# EAGLE design ProjV1 (EAGLE 9.6.2)
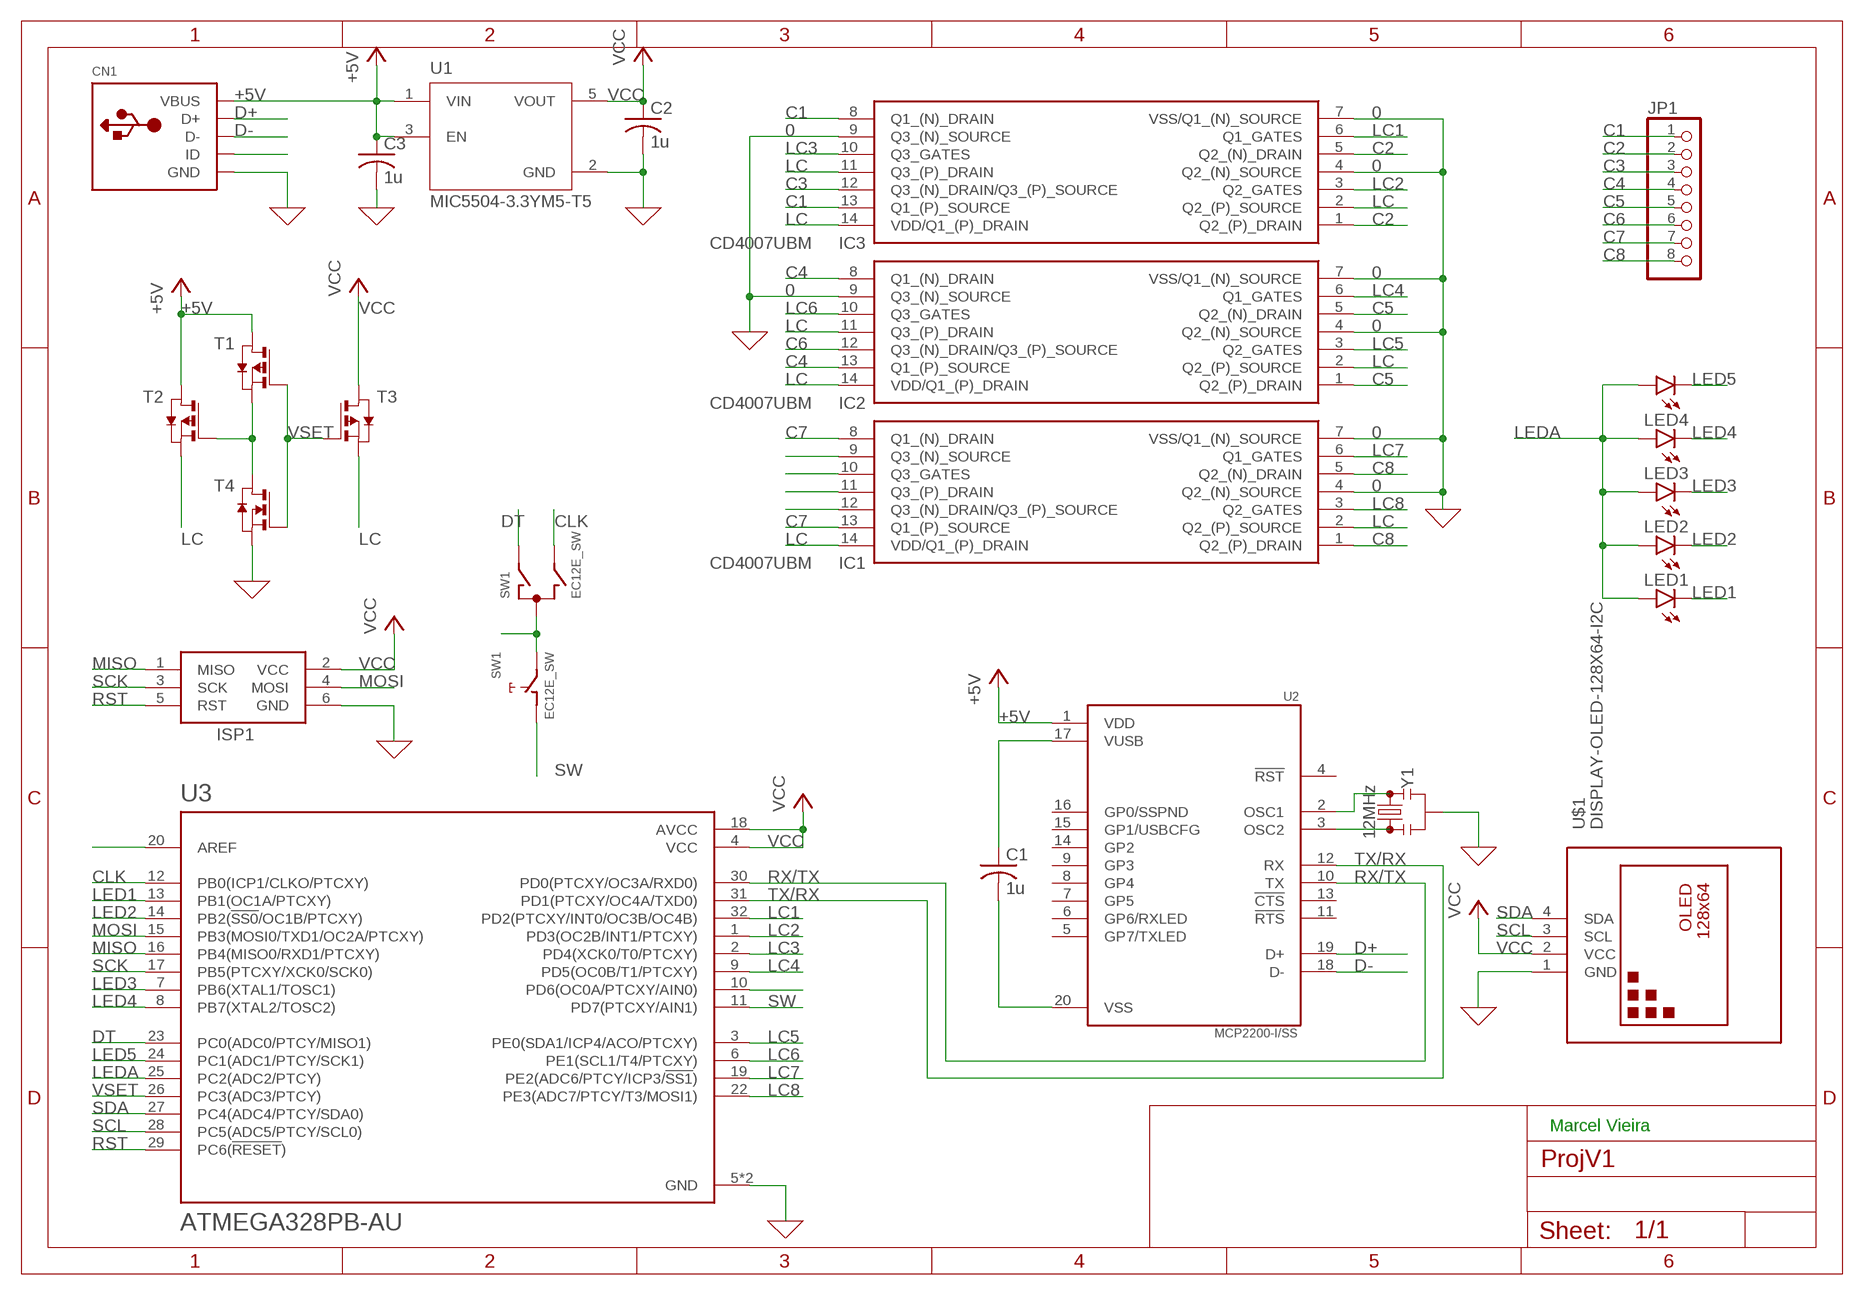
[diagram p0: schematic, sheet 1]

## Parts
C1  1u  C-USC0805  [C0805]
C2  1u  C-USC0805  [C0805]
C3  1u  C-USC0805  [C0805]
CN1  USBMINIB  [USB-MINIB]
IC1  CD4007UBM  [SOIC127P600X175-14N]
IC2  CD4007UBM  [SOIC127P600X175-14N]
IC3  CD4007UBM  [SOIC127P600X175-14N]
ISP1  AVRISP-6  [AVRISP]
JP1  PINHD-1X8-3.5MM  [1X08-3.5MM]
LED1  LEDCHIP-LED0805  [CHIP-LED0805]
LED2  LEDCHIP-LED0805  [CHIP-LED0805]
LED3  LEDCHIP-LED0805  [CHIP-LED0805]
LED4  LEDCHIP-LED0805  [CHIP-LED0805]
LED5  LEDCHIP-LED0805  [CHIP-LED0805]
SW1  EC12E_SW  [ALPS_EC12E_SW]
T1  PMOSSOT23  [SOT-23]
T2  PMOSSOT23  [SOT-23]
T3  PMOSSOT23  [SOT-23]
T4  NMOSSOT23  [SOT-23]
U1  MIC5504-3.3YM5-T5  [SOT95P280X145-5N]
U2  MCP2200-I/SS  [SOP65P780X200-20N]
U3  ATMEGA328PB-AU  [QFP80P900X900X120-32N]
U$1  DISPLAY-OLED-128X64-I2C  [DISPLAY-OLED-128X64-I2C]
Y1  12MHz  RESONATOR-16MHZSMD_3.2X1.3  [RESONATOR-SMD-3.2X1.3]

## Nets
0: C2.2 C3.2 CN1.GND IC1.4(Q2_(N)_SOURCE) IC1.7(VSS/Q1_(N)_SOURCE) IC2.4(Q2_(N)_SOURCE) IC2.7(VSS/Q1_(N)_SOURCE) IC2.9(Q3_(N)_SOURCE) IC3.4(Q2_(N)_SOURCE) IC3.7(VSS/Q1_(N)_SOURCE) IC3.9(Q3_(N)_SOURCE) ISP1.6(GND) T4.2(S) U1.2(GND) U3.5(GND) U3.21(GND) U$1.1(GND) Y1.2 ; supply symbol labelled GND
+5V: C3.1 CN1.VBUS T1.1(D) T2.1(D) U1.1(VIN) U1.3(EN) U2.1(VDD)
C1: IC3.8(Q1_(N)_DRAIN) IC3.13(Q1_(P)_SOURCE) JP1.1
C2: IC3.1(Q2_(P)_DRAIN) IC3.5(Q2_(N)_DRAIN) JP1.2
C3: IC3.12(Q3_(N)_DRAIN/Q3_(P)_SOURCE) JP1.3
C4: IC2.8(Q1_(N)_DRAIN) IC2.13(Q1_(P)_SOURCE) JP1.4
C5: IC2.1(Q2_(P)_DRAIN) IC2.5(Q2_(N)_DRAIN) JP1.5
C6: IC2.12(Q3_(N)_DRAIN/Q3_(P)_SOURCE) JP1.6
C7: IC1.8(Q1_(N)_DRAIN) IC1.13(Q1_(P)_SOURCE) JP1.7
C8: IC1.1(Q2_(P)_DRAIN) IC1.5(Q2_(N)_DRAIN) JP1.8
CLK: SW1.B U3.12(PB0(ICP1/CLKO/PTCXY))
D+: CN1.D+ U2.19(D+)
D-: CN1.D- U2.18(D-)
DT: SW1.A U3.23(PC0(ADC0/PTCY/MISO1))
LC: IC1.2(Q2_(P)_SOURCE) IC1.14(VDD/Q1_(P)_DRAIN) IC2.2(Q2_(P)_SOURCE) IC2.11(Q3_(P)_DRAIN) IC2.14(VDD/Q1_(P)_DRAIN) IC3.2(Q2_(P)_SOURCE) IC3.11(Q3_(P)_DRAIN) IC3.14(VDD/Q1_(P)_DRAIN) T2.2(S) T3.2(S)
LC1: IC3.6(Q1_GATES) U3.32(PD2(PTCXY/INT0/OC3B/OC4B))
LC2: IC3.3(Q2_GATES) U3.1(PD3(OC2B/INT1/PTCXY))
LC3: IC3.10(Q3_GATES) U3.2(PD4(XCK0/T0/PTCXY))
LC4: IC2.6(Q1_GATES) U3.9(PD5(OC0B/T1/PTCXY))
LC5: IC2.3(Q2_GATES) U3.3(PE0(SDA1/ICP4/ACO/PTCXY))
LC6: IC2.10(Q3_GATES) U3.6(PE1(SCL1/T4/PTCXY))
LC7: IC1.6(Q1_GATES) U3.19(PE2(ADC6/PTCY/ICP3/!SS1!))
LC8: IC1.3(Q2_GATES) U3.22(PE3(ADC7/PTCY/T3/MOSI1))
LED1: LED1.C U3.13(PB1(OC1A/PTCXY))
LED2: LED2.C U3.14(PB2(!SS0!/OC1B/PTCXY))
LED3: LED3.C U3.7(PB6(XTAL1/TOSC1))
LED4: LED4.C U3.8(PB7(XTAL2/TOSC2))
LED5: LED5.C U3.24(PC1(ADC1/PTCY/SCK1))
LEDA: LED1.A LED2.A LED3.A LED4.A LED5.A U3.25(PC2(ADC2/PTCY))
MISO: ISP1.1(MISO) U3.16(PB4(MISO0/RXD1/PTCXY))
MOSI: ISP1.4(MOSI) U3.15(PB3(MOSI0/TXD1/OC2A/PTCXY))
N$1: IC1.9(Q3_(N)_SOURCE)
N$2: IC1.10(Q3_GATES)
N$3: IC1.11(Q3_(P)_DRAIN)
N$4: U3.10(PD6(OC0A/PTCXY/AIN0))
N$5: IC1.12(Q3_(N)_DRAIN/Q3_(P)_SOURCE)
N$6: U2.2(OSC1) Y1.1
N$7: SW1.C SW1.E
N$8: CN1.ID
N$9: T1.2(S) T2.3(G) T4.1(D)
N$11: C1.2 U2.20(VSS)
N$14: U2.3(OSC2) Y1.3
N$21: C1.1 U2.17(VUSB)
N$30: U3.20(AREF)
RST: ISP1.5(RST) U3.29(PC6(!RESET!))
RX/TX: U2.10(TX) U3.30(PD0(PTCXY/OC3A/RXD0))
SCK: ISP1.3(SCK) U3.17(PB5(PTCXY/XCK0/SCK0))
SCL: U3.28(PC5(ADC5/PTCY/SCL0)) U$1.3(SCL)
SDA: U3.27(PC4(ADC4/PTCY/SDA0)) U$1.4(SDA)
SW: SW1.D U3.11(PD7(PTCXY/AIN1))
TX/RX: U2.12(RX) U3.31(PD1(PTCXY/OC4A/TXD0))
VCC: C2.1 ISP1.2(VCC) T3.1(D) U1.5(VOUT) U3.4(VCC) U3.18(AVCC) U$1.2(VCC)
VSET: T1.3(G) T3.3(G) T4.3(G) U3.26(PC3(ADC3/PTCY))
Unconnected: SW1.GND1(G) SW1.GND2(G) U2.4(!RST) U2.5(GP7/TXLED) U2.6(GP6/RXLED) U2.7(GP5) U2.8(GP4) U2.9(GP3) U2.11(!RTS) U2.13(!CTS) U2.14(GP2) U2.15(GP1/USBCFG) U2.16(GP0/SSPND)

## Notes on the sheet
- Marcel Vieira

## Library data of the parts
C1-C3 = rcl:C-US: CAPACITOR, American symbol; SPICEPREFIX: C
CN1 = adafruit:USB: USB Connectors USBMINIB - Surface Mount Female Mini-B USB Connector 4UConnector: 06564 By microbuilder.eu Thru-hole RA Female Mini-B USB Connector 4UConnector: 18732 By ladyada.net
IC1-IC3 = CD4007UBM:CD4007UBM: Texas Instruments CD4007UBM Inverter, 3 18 V, 14-Pin SOIC Source: Datasheet <http://www.ti.com/lit/gpn/cd4007ub>; ARROW_PART_NUMBER: CD4007UBM; ARROW_PRICE-STOCK: https://www.arrow.com/en/products/cd4007ubm/texas-instruments; DESCRIPTION: Texas Instruments CD4007UBM Inverter, 3 18 V, 14-Pin SOIC; HEIGHT: 1.75mm; MANUFACTURER_NAME: Texas Instruments; MANUFACTURER_PART_NUMBER: CD4007UBM; MOUSER_PART_NUMBER: 595-CD4007UBM; MOUSER_PRICE-STOCK: https://www.mouser.co.uk/ProductDetail/Texas-Instruments/CD4007UBM?qs=LfG3tU9ud8BhOMkMTdqqtw%3D%3D
ISP1 = adafruit:AVRISP: AVR ISP HEADER Standard 6 pin header for AVR programming
JP1 = adafruit:PINHD-1X8: PIN HEADER
LED1-LED5 = led:LED: LED OSRAM: - CHIPLED LG R971, LG N971, LY N971, LG Q971, LY Q971, LO R971, LY R971 LH N974, LH R974 LS Q976, LO Q976, LY Q976 LO Q996 - Hyper CHIPLED LW Q18S LB Q993, LB Q99A, LB R99A - SideLED LS A670, LO A670, LY A670, LG A670, LP A670 LB A673, LV A673, LT A673, LW A673 LH A674 LY A675 LS A676, LA A676, LO A676, LY A676, LW A676 LS A679, LY A679, LG A679 - Hyper Micro SIDELED® LS Y876, LA Y876, LO Y876, LY Y876 LT Y87S - SmartLED LW L88C, LW L88S LB L89C, LB L89S, LG L890 LS L89K, LO L89K, LY L89K LS L896, LA L896, LO L896, LY L896 - TOPLED LS T670, LO T670, LY T670, LG T670, LP T670 LSG T670, LSP T670, LSY T670, LOP T670, LYG T670 LG T671, LOG T671, LSG T671 LB T673, LV T673, LT T673, LW T673 LH T674 LS T676, LA T676, LO T676, LY T676, LB T676, LH T676, LSB T676, LW T676 LB T67C, LV T67C, LT T67C, LS T67K, LO T67K, LY T67K, LW E67C LS E67B, LA E67B, LO E67B, LY E67B, LB E67C, LV E67C, LT E67C LW T67C LS T679, LY T679, LG T679 LS T770, LO T770, LY T770, LG T770, LP T770 LB T773, LV T773, LT T773, LW T773 LH T774 LS E675, LA E675, LY E675, LS T675 LS T776, LA T776, LO T776, LY T776, LB T776 LHGB T686 LT T68C, LB T68C - Hyper Mini TOPLED® LB M676 - Mini TOPLED Santana® LG M470 LS M47K, LO M47K, LY M47K Source: http://www.osram.convergy.de LUXEON: - LUMILED® LXK2-PW12-R00, LXK2-PW12-S00, LXK2-PW14-U00, LXK2-PW14-V00 LXK2-PM12-R00, LXK2-PM12-S00, LXK2-PM14-U00 LXK2-PE12-Q00, LXK2-PE12-R00, LXK2-PE12-S00, LXK2-PE14-T00, LXK2-PE14-U00 LXK2-PB12-K00, LXK2-PB12-L00, LXK2-PB12-M00, LXK2-PB14-N00, LXK2-PB14-P00, LXK2-PB14-Q00 LXK2-PR12-L00, LXK2-PR12-M00, LXK2-PR14-Q00, LXK2-PR14-R00 LXK2-PD12-Q00, LXK2-PD12-R00, LXK2-PD12-S00 LXK2-PH12-R00, LXK2-PH12-S00 LXK2-PL12-P00, LXK2-PL12-Q00, LXK2-PL12-R00 Source: www.luxeon.com KINGBRIGHT: KA-3528ASYC Source: www.kingbright.com
SW1 = switch-alps:EC12E_SW: ALPS rotary Encoder EC12E series with switch; MPN: EC12E2424407; OC_FARNELL: 1520813; OC_NEWARK: 74M1068
T1-T3 = zetex:PMOSSOT23: MOS FET; OC_FARNELL: unknown; OC_NEWARK: unknown
T4 = zetex:NMOSSOT23: MOS FET; OC_FARNELL: unknown; OC_NEWARK: unknown
U1 = MIC5504-3.3YM5-T5:MIC5504-3.3YM5-T5: Linear Voltage Regulator IC 1 Output 300mA SOT-23-5 Check prices <https://pricing.snapeda.com/parts/MIC5504-3.3YM5-T5/Microchip/view-part?ref=eda>; AVAILABILITY: Good; DESCRIPTION: Linear Voltage Regulator IC 1 Output 300mA SOT-23-5; MF: Microchip; MP: MIC5504-3.3YM5-T5; PACKAGE: SOT-23-5 Microchip; PRICE: None; PURCHASE-URL: https://pricing.snapeda.com/search/part/MIC5504-3.3YM5-T5/?ref=eda
U2 = MCP2200-I_SS:MCP2200-I/SS: MCP2200 Series 5.5 V 8 Channel USB to UART Serial Converter SMT- SSOP-20LD Check prices <https://pricing.snapeda.com/search/part/MCP2200-I/SS/?ref=eda>; AVAILABILITY: Good; DESCRIPTION: USB Bridge, USB to UART USB 2.0 UART Interface 20-SSOP; MF: Microchip; MP: MCP2200-I/SS; PACKAGE: SSOP-20 Microchip; PRICE: None; PURCHASE-URL: https://pricing.snapeda.com/search/part/MCP2200-I/SS/?ref=eda
U3 = ATMEGA328PB-AU:ATMEGA328PB-AU: ATmega Series 20 MHz 32 KB Flash 2 KB SRAM 8-Bit Microcontroller - TQFP-32 Check prices <https://pricing.snapeda.com/search/part/ATMEGA328PB-AU/?ref=eda>; AVAILABILITY: Good; DESCRIPTION: 8-bit Microcontrollers - MCU ATMEGA328PB 20MHZ IND TEMP; MF: Microchip Technology / Atmel; MP: ATMEGA328PB-AU; PACKAGE: None; PRICE: None; PURCHASE-URL: https://pricing.snapeda.com/search/part/ATMEGA328PB-AU/?ref=eda
U$1 = diy-modules:DISPLAY-OLED-128X64-I2C: 128x64 Dot Matrix OLED Module based on SSD1306 chip Variant with I2C interface More details available here: http://www.instructables.com/id/Monochrome-096-i2c-OLED-display-with-arduino-SSD13/ SSD1306 datasheet: https://cdn-shop.adafruit.com/datasheets/SSD1306.pdf Click here to find device on ebay.com <http://www.ebay.com/sch/oled+display+128x64+iic> Note: There are two variants: I2C and SPI. Search for the proper version.
Y1 = SparkFun-Clocks:RESONATOR-16MHZ: 16MHz Resonator Digikey Example <http://www.digikey.com/product-detail/en/murata-electronics-north-america/CSTCE16M0V53-R0/490-1198-1-ND/584635> Frequency: 16MHz Frequency Stability: ±0.3% Frequency Tolerance: ±0.5% Capacitance: 15pF SparkFun Products SparkFun OpenLog <https://www.sparkfun.com/products/13712> SparkFun MicroView - OLED Arduino Module <https://www.sparkfun.com/products/12923>; PROD_ID: XTAL-08900; VALUE: 16MHz

## Board
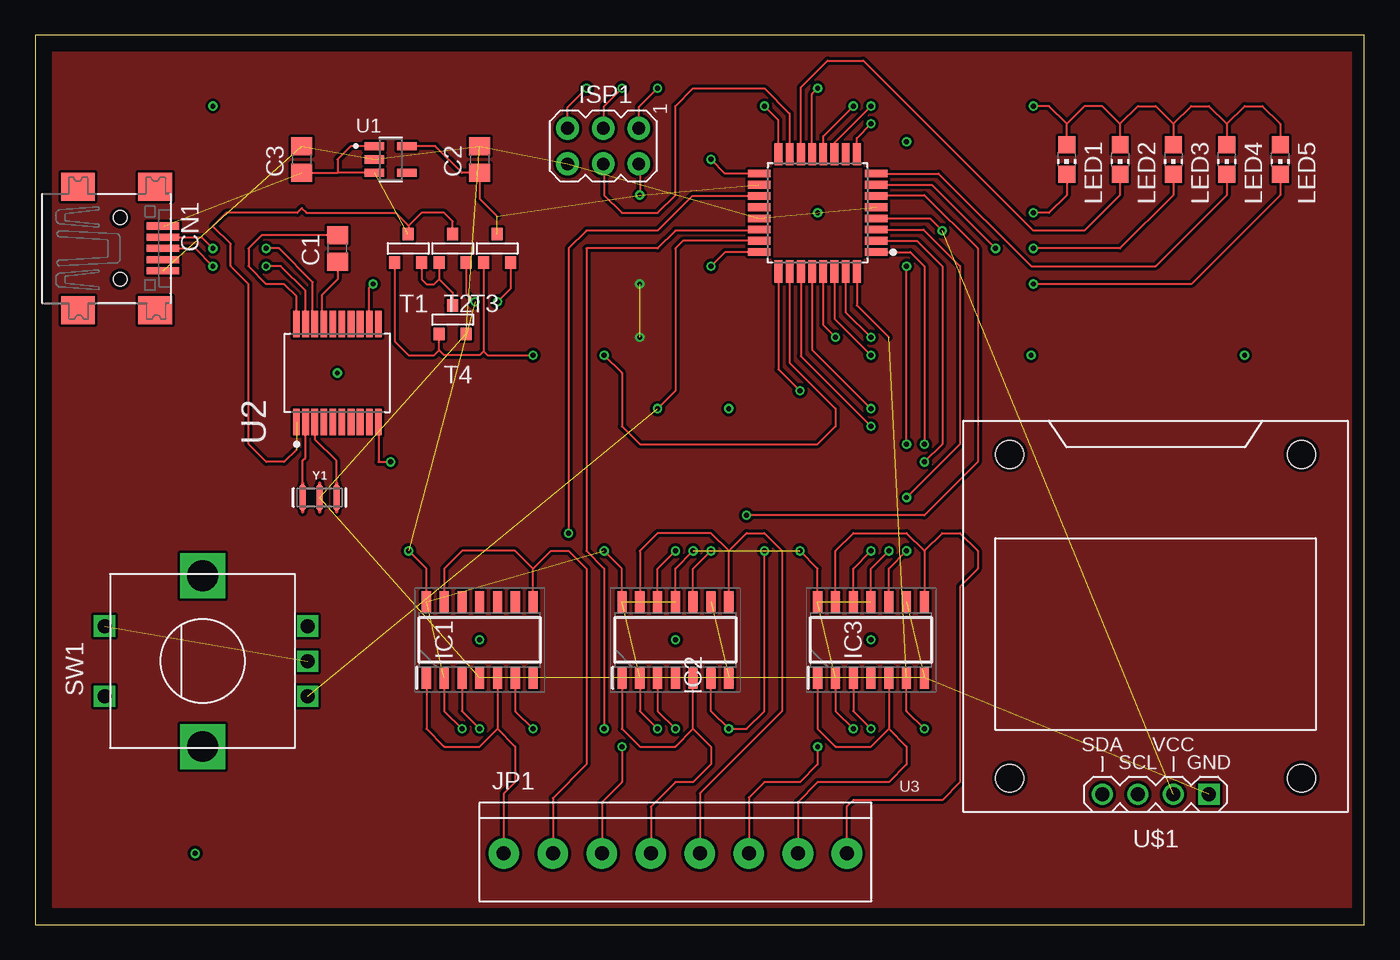
[diagram p1: board, top side]
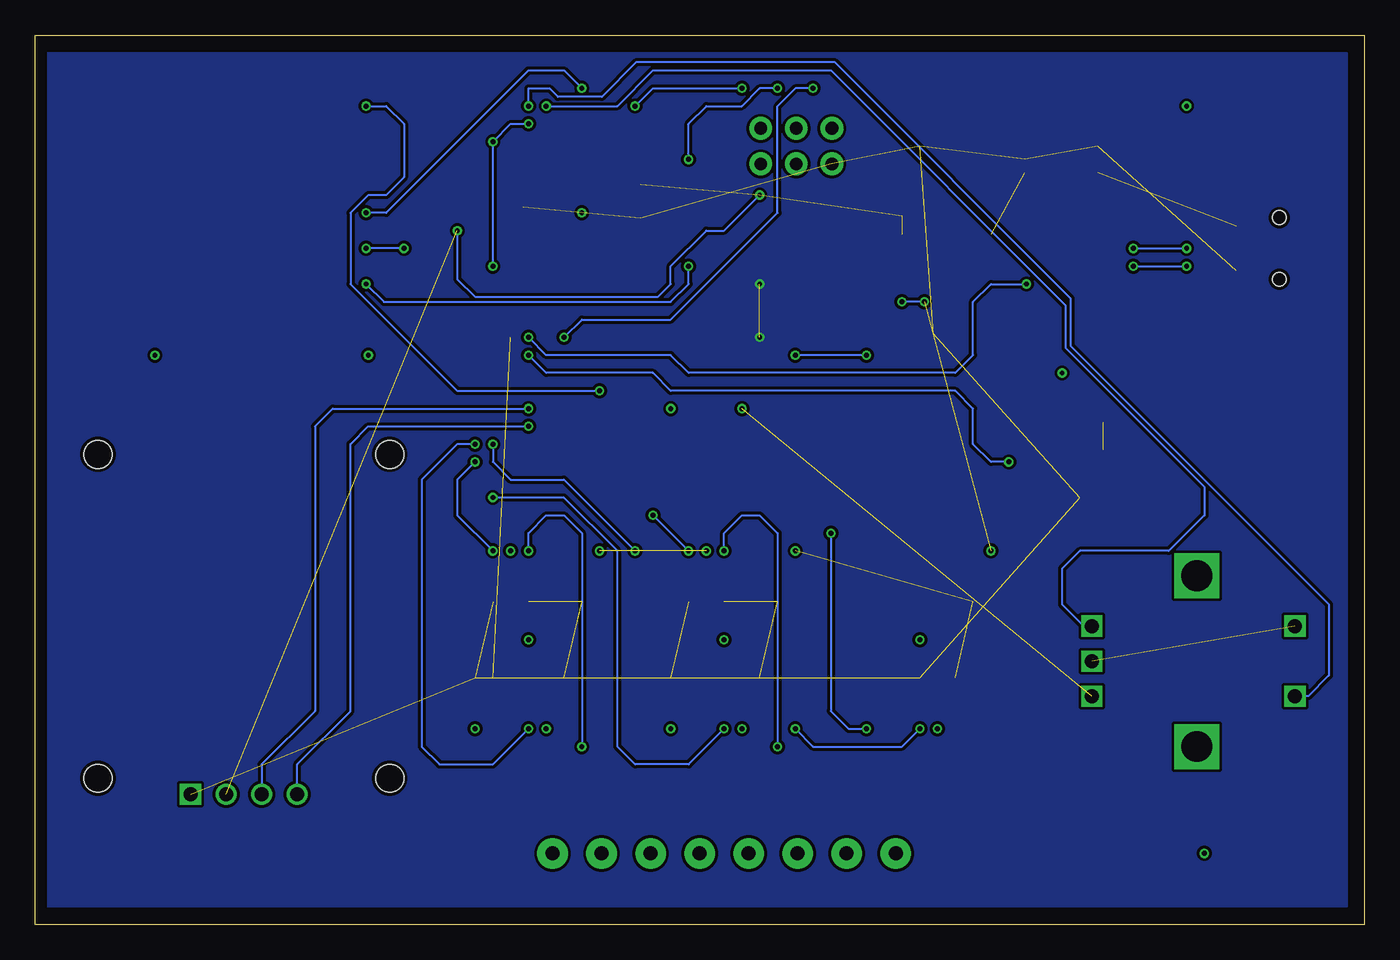
[diagram p2: board, bottom side, seen from below]

Size 94.92 x 63.49 mm. Coordinates in mm from the lower left corner, seen from the top.
Outline: 0,0 94.92,0 94.92,63.49 0,63.49 0,0
Copper layers (1*16): Top 0.035mm / dielectric 1.5mm / Bottom 0.035mm
Design rules "Dirty8TS": minimum track width 5mil, minimum drill 12mil, track to track 8mil, track to pad 8mil, pad to pad 8mil, via to via 8mil, smd to smd 0mil, copper to edge 10mil, drill to drill 10mil, minimum pad ring 10mil, minimum via ring 6mil, stop-mask expansion 2mil, vias tented up to drill 25mil, thermal gap 10mil

### Footprints (pad centres in the part's own frame; a part is rotated, then mirrored left to right if it is on the bottom)
C0805 = smd 1.3 x 1.5: 1 -0.95,0; 2 0.95,0
USB-MINIB = smd 0.5 x 2.308: D+ 0,4.064; D- -0.8,4.064; GND 1.6,4.064; ID 0.8,4.064; VBUS -1.6,4.064 | smd 2 x 2.4: GND1 -4.4,-2; GND2 -4.4,3.5; GND3 4.4,3.5; GND4 4.4,-2 | hole 1: -2.2,1; 2.2,1
SOIC127P600X175-14N = smd 1.525 x 0.65: 1 -2.712,3.81; 2 -2.712,2.54; 3 -2.712,1.27; 4 -2.712,0; 5 -2.712,-1.27; 6 -2.712,-2.54; 7 -2.712,-3.81; 8 2.712,-3.81; 9 2.712,-2.54; 10 2.712,-1.27; 11 2.712,0; 12 2.712,1.27; 13 2.712,2.54; 14 2.712,3.81
AVRISP = drill 0.9 pad 1.626: 1 -1.27,2.54; 2 1.27,2.54; 3 -1.27,0; 4 1.27,0; 5 -1.27,-2.54; 6 1.27,-2.54
1X08-3.5MM = drill 1 pad 2.184: 1 -12.25,0; 2 -8.75,0; 3 -5.25,0; 4 -1.75,0; 5 1.75,0; 6 5.25,0; 7 8.75,0; 8 12.25,0
CHIP-LED0805 = smd 1.2 x 1.2: A 0,-1.05; C 0,1.05
ALPS_EC12E_SW = drill 1 square: A -2.5,-7.5; B 2.5,-7.5; C 0,-7.5; D -2.5,7; E 2.5,7 | drill 2.2 square: GND1 -6.1,0; GND2 6.1,0
SOT-23 = smd 0.787 x 0.889: 1 0.025,-1.016; 2 -0.94,1.016; 3 0.991,1.016
SOT95P280X145-5N = smd 1.39 x 0.58: 1 -1.165,0.95; 2 -1.165,0; 3 -1.165,-0.95; 4 1.165,-0.95; 5 1.165,0.95
SOP65P780X200-20N = smd 1.9 x 0.48: 1 -3.505,2.925; 2 -3.505,2.275; 3 -3.505,1.625; 4 -3.505,0.975; 5 -3.505,0.325; 6 -3.505,-0.325; 7 -3.505,-0.975; 8 -3.505,-1.625; 9 -3.505,-2.275; 10 -3.505,-2.925; 11 3.505,-2.925; 12 3.505,-2.275; 13 3.505,-1.625; 14 3.505,-0.975; 15 3.505,-0.325; 16 3.505,0.325; 17 3.505,0.975; 18 3.505,1.625; 19 3.505,2.275; 20 3.505,2.925
QFP80P900X900X120-32N = smd 1.6 x 0.55: 1 -4.18,2.8; 2 -4.18,2; 3 -4.18,1.2; 4 -4.18,0.4; 5 -4.18,-0.4; 6 -4.18,-1.2; 7 -4.18,-2; 8 -4.18,-2.8; 17 4.18,-2.8; 18 4.18,-2; 19 4.18,-1.2; 20 4.18,-0.4; 21 4.18,0.4; 22 4.18,1.2; 23 4.18,2; 24 4.18,2.8 | smd 0.55 x 1.6: 9 -2.8,-4.18; 10 -2,-4.18; 11 -1.2,-4.18; 12 -0.4,-4.18; 13 0.4,-4.18; 14 1.2,-4.18; 15 2,-4.18; 16 2.8,-4.18; 25 2.8,4.18; 26 2,4.18; 27 1.2,4.18; 28 0.4,4.18; 29 -0.4,4.18; 30 -1.2,4.18; 31 -2,4.18; 32 -2.8,4.18
DISPLAY-OLED-128X64-I2C = drill 1 square: 1 -3.81,12.7 | drill 1: 2 -1.27,12.7; 3 1.27,12.7; 4 3.81,12.7 | hole 2: -10.414,11.557; 10.414,11.557; 10.414,-11.557; -10.414,-11.557
RESONATOR-SMD-3.2X1.3 = smd 0.45 x 1.905: 1 -1.2,0; 2 0,0; 3 1.2,0

### Placement (x,y rotation side)
C1  21.59,48.26 90 top
C2  31.75,54.61 90 top
C3  19.05,54.61 90 top
CN1  5.08,48.26 270 top
IC1  31.75,20.32 90 top
IC2  45.72,20.32 90 top
IC3  59.69,20.32 90 top
ISP1  40.56,55.56 270 top
JP1  45.72,5.08 180 top
LED1  73.66,54.61 180 top
LED2  77.47,54.61 180 top
LED3  81.28,54.61 180 top
LED4  85.09,54.61 180 top
LED5  88.9,54.61 180 top
SW1  11.96,18.81 90 top
T1  26.67,48.26 180 top
T2  29.84,48.26 180 top
T3  33.02,48.26 180 top
T4  29.84,43.18 180 top
U1  25.4,54.61 0 top
U2  21.59,39.37 90 top
U3  55.88,50.8 180 top
U$1  80.01,22 180 top
Y1  20.32,30.48 0 top

### Tracks (layer width: path | path; a pad name or v marks a point on that pad's centre or on a via)
0  (17 unrouted)
+5V  (3 unrouted)
  Top 0.152: C3.1 21.59,53.66 | U1.3 21.59,53.66 | U1.1 22.54,55.56 21.59,54.61 21.59,53.66 | 18.66,33.91 17.78,33.02 16.51,33.02 15.24,34.29 15.24,45.72 13.97,46.99 13.97,48.59 12.7,49.86 13.64,50.8 18.72,50.8 19.05,51.13 19.38,50.8 25.73,50.8 26.66,49.87 | T2.1 29.82,50.19 29.21,50.8 27.59,50.8 26.66,49.87 | 26.66,49.87 26.66,49.29 T1.1
C1
  Top 0.152: IC3.13 57.15,26.67 58.42,27.94 62.23,27.94 63.5,26.67 | 63.5,26.67 IC3.8 | JP1.1 57.97,8.44 58.42,8.89 64.77,8.89 66.04,10.16 66.04,24.13 67.31,25.4 67.31,26.67 66.04,27.94 64.77,27.94 63.5,26.67
C2
  Top 0.152: IC3.1 55.88,13.97 57.15,12.7 59.69,12.7 60.96,13.97 | IC3.5 60.96,13.97 | 60.96,13.97 62.23,12.7 62.23,11.43 60.96,10.16 55.88,10.16 54.47,8.75 JP1.2
C3  (via drill 0.35)
  Top 0.152: IC3.12 58.42,25.4 v59.69,26.67 | v55.88,12.7 55.88,11.43 54.61,10.16 52.07,10.16 50.97,9.06 JP1.3
  Bottom 0.152: v59.69,26.67 59.69,27.94 58.42,29.21 57.15,29.21 55.88,27.94 v55.88,12.7
C4
  Top 0.152: IC2.8 49.53,26.67 | 49.53,26.67 48.26,27.94 44.45,27.94 43.18,26.67 IC2.13 | 49.53,26.67 50.8,27.94 52.07,27.94 53.34,26.67 53.34,15.24 47.47,9.37 JP1.4
C5
  Top 0.152: 42.08,17.61 IC2.1 41.91,13.97 43.18,12.7 45.72,12.7 46.99,13.97 | 46.99,13.97 IC2.5 | 46.99,13.97 48.26,12.7 48.26,11.43 46.99,10.16 45.72,10.16 43.97,8.41 JP1.5
C6  (via drill 0.35)
  Top 0.152: IC2.12 44.45,25.4 v45.72,26.67 | v41.91,12.7 41.91,10.16 40.47,8.72 JP1.6
  Bottom 0.152: v45.72,26.67 45.72,27.94 44.45,29.21 43.18,29.21 41.91,27.94 v41.91,12.7
C7
  Top 0.152: IC1.8 35.56,25.4 | 35.56,25.4 34.29,26.67 30.48,26.67 29.21,25.4 IC1.13 | 35.56,25.4 36.83,26.67 38.1,26.67 39.37,25.4 39.37,11.43 36.97,9.03 JP1.7
C8
  Top 0.152: 33.02,13.97 31.75,12.7 29.21,12.7 27.94,13.97 IC1.1 | IC1.5 33.02,13.97 | 33.02,13.97 34.29,12.7 34.29,10.16 33.47,9.34 JP1.8
CLK  (via drill 0.35)
  Top 0.152: U3.12 56.28,56.28 v58.42,58.42
  Bottom 0.152: v58.42,58.42 53.34,58.42 50.8,60.96 38.1,60.96 21.34,44.2 21.34,41.16 11.43,31.25 11.43,29.21 13.97,26.67 20.32,26.67 21.59,25.4 21.59,22.86 20.04,21.31 SW1.B
D+  (via drill 0.35)
  Top 0.152: v16.51,46.99 17.55,46.99 19.31,45.23 U2.19 | CN1.D+ 11.43,48.26 v12.7,46.99
  Bottom 0.152: v16.51,46.99 v12.7,46.99
D-  (via drill 0.35)
  Top 0.152: v16.51,48.26 17.42,48.26 19.83,45.85 19.83,43.01 U2.18 | CN1.D- 11.9,49.06 v12.7,48.26
  Bottom 0.152: v16.51,48.26 v12.7,48.26
DT  (via drill 0.35)  (1 unrouted)
  Top 0.152: U3.23 46.26,48.8 45.72,48.26 45.72,38.1 v44.45,36.83
GND  (via drill 0.35)  (1 unrouted)
  other vias: 43.18,45.72 43.18,41.91
  pour Bottom (isolate 0.008): 1.27,62.23 1.27,1.27 93.98,1.27 93.98,62.23
  pour Top (isolate 0.008): 1.27,62.23 1.27,1.27 93.98,1.27 93.98,62.23
LC  (via drill 0.35)  (8 unrouted)
  Top 0.152: 30.94,47.24 T2.2 30.79,45.09 v31.42,44.45 | T3.2 33.96,45.39 v33.02,44.45 | IC1.2 29.21,15.24 v30.48,13.97 | IC2.11 45.72,25.4 v46.99,26.67 | IC2.2 43.18,15.24 v44.45,13.97 | IC2.14 41.91,25.4 v40.64,26.67 | IC1.14 27.94,25.4 v26.67,26.67 | IC3.14 55.88,25.4 v54.61,26.67 | IC3.11 59.69,25.4 v60.96,26.67 | IC3.2 57.15,15.24 v58.42,13.97
  Bottom 0.152: v31.42,44.45 v33.02,44.45
LC1  (via drill 0.35)  (1 unrouted)
  Top 0.152: U3.32 58.68,44.19 60.96,41.91 | IC3.6 62.23,15.24 v63.5,13.97
LC2  (via drill 0.35)
  Top 0.152: IC3.3 58.42,15.24 v59.69,13.97 | v63.5,34.29 63.5,46.99 62.49,48 U3.1
  Bottom 0.152: v63.5,34.29 64.77,34.29 67.31,31.75 67.31,12.7 66.04,11.43 62.23,11.43 v59.69,13.97
LC3  (via drill 0.35)
  Top 0.152: IC3.10 60.96,25.4 v62.23,26.67 | U3.2 62.96,48.8 64.77,46.99 64.77,34.29 v63.5,33.02
  Bottom 0.152: v63.5,33.02 64.77,31.75 64.77,29.21 v62.23,26.67
LC4  (via drill 0.35)
  Top 0.152: IC2.6 48.26,15.24 v49.53,13.97 50.8,13.97 52.07,15.24 v52.07,26.67 | U3.9 58.68,56.14 v59.69,57.15 | v62.23,34.29 v62.23,46.99
  Bottom 0.152: v52.07,26.67 57.15,31.75 60.96,31.75 62.23,33.02 v62.23,34.29 | v62.23,46.99 v62.23,55.88 60.96,57.15 v59.69,57.15
LC5  (via drill 0.35)
  Top 0.152: IC2.3 44.45,15.24 v45.72,13.97 | U3.3 63.43,49.6 66.04,46.99 66.04,34.29 v62.23,30.48
  Bottom 0.152: v45.72,13.97 48.26,11.43 52.07,11.43 53.34,12.7 53.34,26.67 57.15,30.48 v62.23,30.48
LC6  (via drill 0.35)
  Top 0.152: IC2.10 46.99,25.4 v48.26,26.67 | U3.6 60.13,52.07 63.5,52.07 67.31,48.26 67.31,33.02 63.5,29.21 v50.8,29.21
  Bottom 0.152: v50.8,29.21 v48.26,26.67
LC7  (via drill 0.35)
  Top 0.152: IC1.6 34.29,15.24 v35.56,13.97 | U3.19 46.92,52 44.45,49.53 39.37,49.53 38.1,48.26 v38.1,27.94
  Bottom 0.152: v38.1,27.94 38.1,15.24 36.83,13.97 v35.56,13.97
LC8  (via drill 0.35)
  Top 0.152: IC1.3 30.48,15.24 v31.75,13.97 | U3.22 51.63,49.53 45.72,49.53 44.45,48.26 39.37,48.26 39.37,26.67 40.64,25.4 v40.64,13.97
  Bottom 0.152: v40.64,13.97 39.37,12.7 33.02,12.7 v31.75,13.97
LED1  (via drill 0.35)
  Top 0.152: LED1.C 73.66,52.07 72.39,50.8 v71.27,50.8 | U3.13 55.48,59.29 v55.88,59.69
  Bottom 0.152: v55.88,59.69 57.15,60.96 59.69,60.96 69.85,50.8 v71.27,50.8
LED2
  Top 0.152: LED2.C 77.47,52.07 74.93,49.53 71.27,49.53 59.13,61.67 56.59,61.67 54.68,59.76 U3.14
LED3  (via drill 0.35)
  Top 0.152: LED3.C 81.28,52.07 77.47,48.26 v71.27,48.26 | U3.7 64.04,52.8 v68.58,48.26
  Bottom 0.152: v68.58,48.26 v71.27,48.26
LED4
  Top 0.152: LED4.C 85.09,52.07 80.01,46.99 71.12,46.99 64.51,53.6 U3.8
LED5  (via drill 0.35)
  Top 0.152: LED5.C 88.9,52.07 82.55,45.72 v71.27,45.72 | U3.24 49.27,48 v48.26,46.99
  Bottom 0.152: v48.26,46.99 48.26,45.72 49.53,44.45 70,44.45 v71.27,45.72
LEDA  (via drill 0.35)
  Top 0.152: LED1.A 73.66,57.15 | 73.66,57.15 72.39,58.42 v71.27,58.42 | 77.47,57.15 76.2,58.42 74.93,58.42 73.66,57.15 | 77.47,57.15 78.74,58.42 80.01,58.42 81.28,57.15 | 81.28,57.15 82.55,58.42 83.82,58.42 85.09,57.15 | 81.28,57.15 LED3.A | 77.47,57.15 LED2.A | U3.25 53.08,39.63 v54.61,38.1 | 85.09,57.15 LED4.A | 85.09,57.15 86.36,58.42 87.63,58.42 88.9,57.15 LED5.A
  Bottom 0.152: v71.27,58.42 69.85,58.42 68.58,57.15 68.58,53.34 69.85,52.07 71.12,52.07 72.39,50.8 72.39,45.72 64.77,38.1 v54.61,38.1
MISO  (via drill 0.35)
  Top 0.152: U3.16 53.08,57.41 v52.07,58.42 | ISP1.1 43.1,58.34 v44.45,59.69
  Bottom 0.152: v52.07,58.42 50.8,59.69 v44.45,59.69
MOSI
  Top 0.152: ISP1.4 40.64,54.22 40.64,52.07 41.91,50.8 44.45,50.8 45.72,52.07 45.72,58.42 46.99,59.69 52.07,59.69 53.88,57.88 U3.15
N$6
  Top 0.152: U2.2 19.31,33.33 19.12,33.13 Y1.1
N$7  (1 unrouted)
N$9
  Top 0.152: 29.46,44.2 T4.1 29.82,45.11 28.85,46.08 | T2.3 28.85,46.08 | T1.2 27.61,46.05 27.94,45.72 28.5,45.72 28.85,46.08
N$10  (via drill 0.35)
  other vias: 49.53,36.83
N$11
  Top 0.152: C1.2 16.19,49.21 15.24,48.26 15.24,46.99 16.51,45.72 17.78,45.72 18.66,44.84 U2.20 18.66,43.56
N$12  (via drill 0.35)
  other vias: 71.12,40.64
N$13  (via drill 0.35)
  other vias: 86.36,40.64
N$14
  Top 0.152: U2.3 19.96,34.64 21.52,33.09 Y1.3
N$15  (via drill 0.35)
  other vias: 11.43,5.08
N$16  (via drill 0.35)
  other vias: 12.7,58.42
N$17  (via drill 0.35)
  other vias: 21.59,39.37
N$18  (via drill 0.35)
  other vias: 55.88,50.8
N$19  (via drill 0.35)
  other vias: 45.72,20.32
N$20  (via drill 0.35)
  other vias: 31.75,20.32
N$21
  Top 0.152: C1.1 21.59,46.06 20.48,44.95 20.48,43.01 U2.17
N$22  (via drill 0.35)
  other vias: 59.69,20.32
RST  (via drill 0.35)
  Top 0.152: U3.29 56.28,42.78 v57.15,41.91 | ISP1.5 38.02,58.34 v39.37,59.69
  Bottom 0.152: v39.37,59.69 40.64,59.69 41.91,58.42 41.91,50.8 49.53,43.18 55.88,43.18 v57.15,41.91
RX/TX  (via drill 0.35)
  Top 0.152: v59.69,40.64 57.08,43.25 U3.30 | U2.10 24.52,33.02 v25.4,33.02
  Bottom 0.152: v25.4,33.02 26.67,33.02 27.94,34.29 27.94,36.83 29.21,38.1 49.53,38.1 50.8,39.37 58.42,39.37 v59.69,40.64
SCK  (via drill 0.35)
  Top 0.152: ISP1.3 40.64,56.91 40.64,58.42 v41.91,59.69 | U3.17 49.27,53.6 v48.26,54.61
  Bottom 0.152: v41.91,59.69 43.18,59.69 44.45,58.42 46.99,58.42 48.26,57.15 v48.26,54.61
SCL  (via drill 0.35)
  Top 0.152: U3.28 55.48,41.04 v59.69,36.83
  Bottom 0.152: v59.69,36.83 73.66,36.83 74.93,35.56 74.93,15.24 78.74,11.43 U$1.3
SDA  (via drill 0.35)
  Top 0.152: U3.27 54.68,40.57 v59.69,35.56
  Bottom 0.152: v59.69,35.56 71.12,35.56 72.39,34.29 72.39,15.24 76.2,11.43 U$1.4
SW  (via drill 0.35)
  Top 0.152: U3.11 57.08,55.81 v59.69,58.42
  Bottom 0.152: v59.69,58.42 59.69,59.69 58.19,59.69 57.58,59.08 54.45,59.08 51.97,61.57 37.85,61.57 20.98,44.7 20.98,41.3 2.54,22.86 2.54,17.78 4.01,16.31 SW1.D
TX/RX  (via drill 0.35)
  Top 0.152: v59.69,41.91 57.88,43.72 U3.31 | U2.12 23.86,45.45 v24.13,45.72
  Bottom 0.152: v24.13,45.72 26.67,45.72 27.94,44.45 27.94,40.64 29.21,39.37 48.26,39.37 49.53,40.64 58.42,40.64 v59.69,41.91
VCC  (via drill 0.35)  (4 unrouted)
  Top 0.152: ISP1.2 43.18,54.22 v43.18,52.07 | U3.4 63.9,50.4 v64.77,49.53 | 32.99,50.55 31.75,51.79 C2.1 30.48,53.66 28.58,55.56 U1.5 26.99,55.56
  Bottom 0.152: v64.77,49.53 64.77,46.08 63.5,44.81 50.44,44.81 49.53,45.72 49.53,46.99 46.99,49.53 45.72,49.53 v43.18,52.07
VSET  (via drill 0.35)
  Top 0.152: 28.85,41 29.21,40.64 31.75,40.64 32.03,40.92 | 28.85,41 T4.3 | T3.3 32.03,40.92 | T1.3 25.68,41.63 26.67,40.64 28.5,40.64 28.85,41 | U3.26 53.88,40.1 57.15,36.83 57.15,35.56 55.88,34.29 43.18,34.29 41.91,35.56 41.91,39.37 v40.64,40.64 | 32.03,40.92 32.31,40.64 v35.56,40.64
  Bottom 0.152: v35.56,40.64 v40.64,40.64